# Altium schematic sheet Main_Sheet.SchDoc
size A4
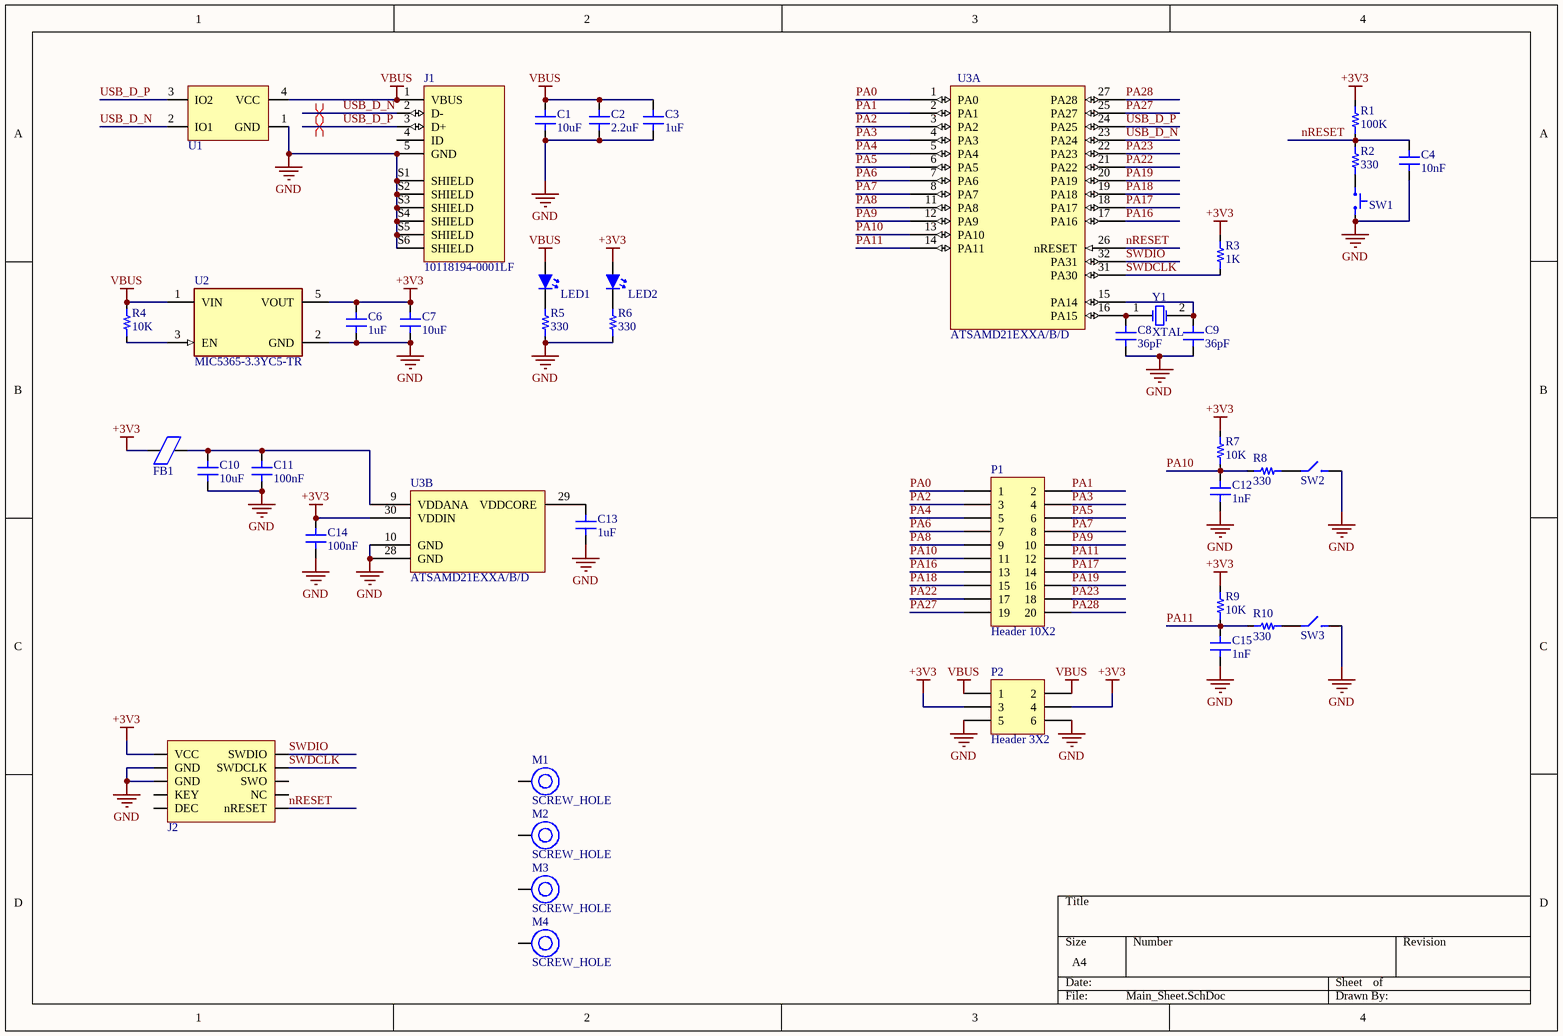
[diagram p0: Main_Sheet.SchDoc]

## Parts
C1  value 10uF  [C0603]  (hidden comment: Cap)
C2  value 2.2uF  [C0603]  (hidden comment: Cap)
C3  value 1uF  [C0603]  (hidden comment: Cap)
C4  value 10nF  [C0603]  (hidden comment: Cap)
C6  value 1uF  [C0603]  (hidden comment: Cap)
C7  value 10uF  [C0603]  (hidden comment: Cap)
C8  value 36pF  [C0603]  (hidden comment: Cap)
C9  value 36pF  [C0603]  (hidden comment: Cap)
C10  value 10uF  [C0603]  (hidden comment: Cap)
C11  value 100nF  [C0603]  (hidden comment: Cap)
C12  value 1nF  [C0603]  (hidden comment: Cap)
C13  value 1uF  [C0603]  (hidden comment: Cap)
C14  value 100nF  [C0603]  (hidden comment: Cap)
C15  value 1nF  [C0603]  (hidden comment: Cap)
FB1  Ferrite Bead  [C0603]  (value not drawn)
J1  10118194-0001LF  [AMPHENOL_10103592-0001LF]
J2  SWD_10_PIN  [IPC_5X2_1.27MM]  (value not drawn)
LED1  LED  [LED0805]  (value not drawn)
LED2  LED  [LED0805]  (value not drawn)
M1  SCREW_HOLE  [SCREW_M2]
M2  SCREW_HOLE  [SCREW_M2]
M3  SCREW_HOLE  [SCREW_M2]
M4  SCREW_HOLE  [SCREW_M2]
P1  Header 10X2  [HDR2X10]
P2  Header 3X2  [HDR2X3]
R1  value 100K  [R0603]  (hidden comment: Res)
R2  value 330  [R0603]  (hidden comment: Res)
R3  value 1K  [R0603]  (hidden comment: Res)
R4  value 10K  [R0603]  (hidden comment: Res)
R5  value 330  [R0603]  (hidden comment: Res)
R6  value 330  [R0603]  (hidden comment: Res)
R7  value 10K  [R0603]  (hidden comment: Res)
R8  value 330  [R0603]  (hidden comment: Res)
R9  value 10K  [R0603]  (hidden comment: Res)
R10  value 330  [R0603]  (hidden comment: Res)
SW1  Button  [STU-057A23AX]  (value not drawn)
SW2  CHERRY-MX  [CHERRY_MX_1.0]  (value not drawn)
SW3  CHERRY-MX  [CHERRY_MX_1.0]  (value not drawn)
U1  5.5V TVS Diode  [SOT143]  (value not drawn)
U2  MIC5365-3.3YC5-TR  [SOT65P210X110-5N]
U3  ATSAMD21EXXA/B/D  [QFP80P900X900X120-32N]  (parts A,B of 2)
Y1  XTAL  [SMD-4]

## Nets
+3V3: C6.1 C7.1 C14.1 FB1.1 J2.1(VCC) LED2.1(A) P2.3 P2.4 R1.1 R3.1 R7.1 R9.1 U2.5(VOUT) U3.30(VDDIN)
GND: C1.2 C2.2 C3.2 C4.2 C6.2 C7.2 C8.2 C9.2 C10.2 C11.2 C12.2 C13.2 C14.2 C15.2 J1.5(GND) J1.S1(SHIELD) J1.S2(SHIELD) J1.S3(SHIELD) J1.S4(SHIELD) J1.S5(SHIELD) J1.S6(SHIELD) J2.3(GND) J2.5(GND) P2.5 P2.6 R5.2 R6.2 SW1.1 SW2.2 SW3.2 U1.1(GND) U2.2(GND) U3.10(GND) U3.28(GND)
VBUS: C1.1 C2.1 C3.1 J1.1(VBUS) LED1.1(A) P2.1 P2.2 R4.1 U1.4(VCC) U2.1(VIN)
nRESET: C4.1 J2.10(nRESET) R1.2 R2.1 U3.26(nRESET)
PA0: P1.1 U3.1(PA0)
PA1: P1.2 U3.2(PA1)
PA2: P1.3 U3.3(PA2)
PA3: P1.4 U3.4(PA3)
PA4: P1.5 U3.5(PA4)
PA5: P1.6 U3.6(PA5)
PA6: P1.7 U3.7(PA6)
PA7: P1.8 U3.8(PA7)
PA8: P1.9 U3.11(PA8)
PA9: P1.10 U3.12(PA9)
PA10: C12.1 P1.11 R7.2 R8.1 U3.13(PA10)
PA11: C15.1 P1.12 R9.2 R10.1 U3.14(PA11)
PA16: P1.13 U3.17(PA16)
PA17: P1.14 U3.18(PA17)
PA18: P1.15 U3.19(PA18)
PA19: P1.16 U3.20(PA19)
PA22: P1.17 U3.21(PA22)
PA23: P1.18 U3.22(PA23)
PA27: P1.19 U3.25(PA27)
PA28: P1.20 U3.27(PA28)
SWDCLK: J2.4(SWDCLK) R3.2 U3.31(PA30)
SWDIO: J2.2(SWDIO) U3.32(PA31)
USB_D_N: J1.2(D-) U1.2(IO1) U3.23(PA24)
USB_D_P: J1.3(D+) U1.3(IO2) U3.24(PA25)
NetC8_1: C8.1 U3.16(PA15) Y1.1(OSC1)
NetC9_1: C9.1 U3.15(PA14) Y1.2(OSC2)
NetC10_1: C10.1 C11.1 FB1.2 U3.9(VDDANA)
NetC13_1: C13.1 U3.29(VDDCORE)
NetLED1_2: LED1.2(K) R5.1
NetLED2_2: LED2.2(K) R6.1
NetR2_2: R2.2 SW1.2
NetR4_2: R4.2 U2.3(EN)
NetR8_2: R8.2 SW2.1
NetR10_2: R10.2 SW3.1

Not connected (* = marked no-connect by the designer): J1 4(ID); J2 6(SWO) 7(KEY) 8(NC) 9(DEC); M1 38; M2 38; M3 38; M4 38

## Layout directives
differential pair: USB_D_N, USB_D_P

## Library data of the parts
J1 = 10118194-0001LF: USB - micro B USB 2.0 Receptacle Connector 5 Position Surface Mount, Right Angle; Through Hole; MF: Amphenol ICC; Package: None; Price: None; Availability: Unavailable; MP: 10118194-0001LF; SnapEDA_Link: https://www.snapeda.com/parts/10118194-0001LF/Amphenol%20FCI/view-part/1413308/?ref=snap; Value: *
P1 = Header 10X2: Header, 10-Pin, Dual row; LatestRevisionDate: 17-Jul-2002; LatestRevisionNote: Re-released for DXP Platform.; Publisher: Altium Limited
P2 = Header 3X2: Header, 3-Pin, Dual row; LatestRevisionDate: 17-Jul-2002; LatestRevisionNote: Re-released for DXP Platform.; Publisher: Altium Limited
SW1 = Button: Push Button
U1 = PRTR5V0U2X
U2 = MIC5365-3.3YC5-TR: Lin Reg 150mA SC-70-5; Package: None; Price: None; Value: *; MP: MIC5365-3.3YC5-TR; Availability: Unavailable
Y1 = XTAL: ECS-120-10-33B-CKM-TR; pin to pad: 2>3; Published: 8-Jun-2000; LatestRevisionDate: 17-Jul-2002; LatestRevisionNote: Re-released for DXP Platform.; PackageReference: R38; Publisher: Altium Limited; PackageDescription: Crystal, Thru-Hole; 2 Leads; Body 3.1 x 8.2 mm (Dia.xH)